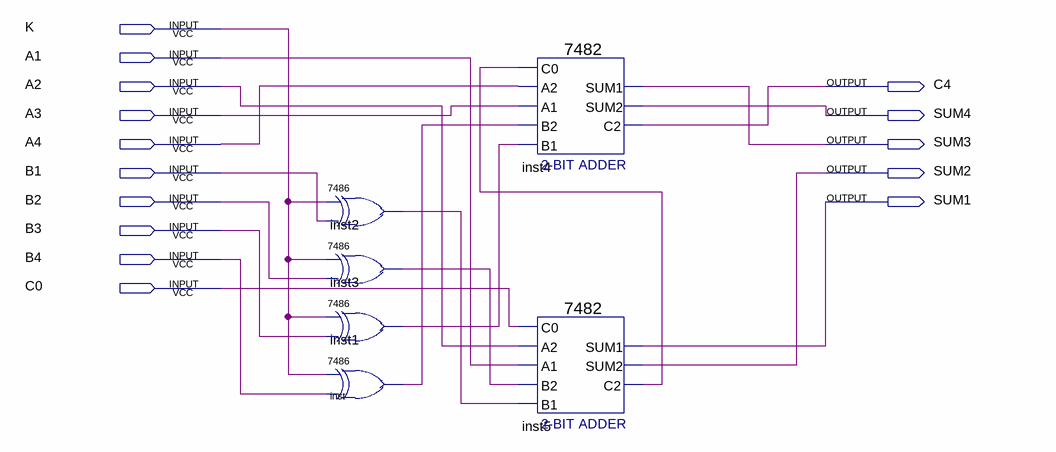
[diagram p0: schematic sheet]
// Quartus schematic expreriment3.bdf as structural Verilog: 6 symbols, 15 pins
module expreriment3 (
  input  K,
  input  A1,
  input  A2,
  input  A3,
  input  A4,
  input  B1,
  input  B2,
  input  B3,
  input  B4,
  input  C0,
  output C4,
  output SUM4,
  output SUM3,
  output SUM2,
  output SUM1
);

  wire inst1_1, inst2_1, inst3_1, inst5_c2, inst_1;

  \7486  inst2 (.\2 (K), .\3 (B1), .\1 (inst2_1));
  \7486  inst3 (.\2 (K), .\3 (B2), .\1 (inst3_1));
  \7486  inst1 (.\2 (K), .\3 (B3), .\1 (inst1_1));
  \7486  inst (.\2 (K), .\3 (B4), .\1 (inst_1));
  \7482  inst4 (.A2(A4), .B2(inst_1), .B1(inst1_1), .C0(inst5_c2), .A1(A3), .C2(C4), .SUM1(SUM3), .SUM2(SUM4));
  \7482  inst5 (.A2(A2), .B2(inst3_1), .B1(inst2_1), .C0(C0), .A1(A1), .C2(inst5_c2), .SUM1(SUM1), .SUM2(SUM2));
endmodule
